# Altium schematic sheet constantCV.SchDoc
size A4; SheetNumber: 1; SheetTotal: 4
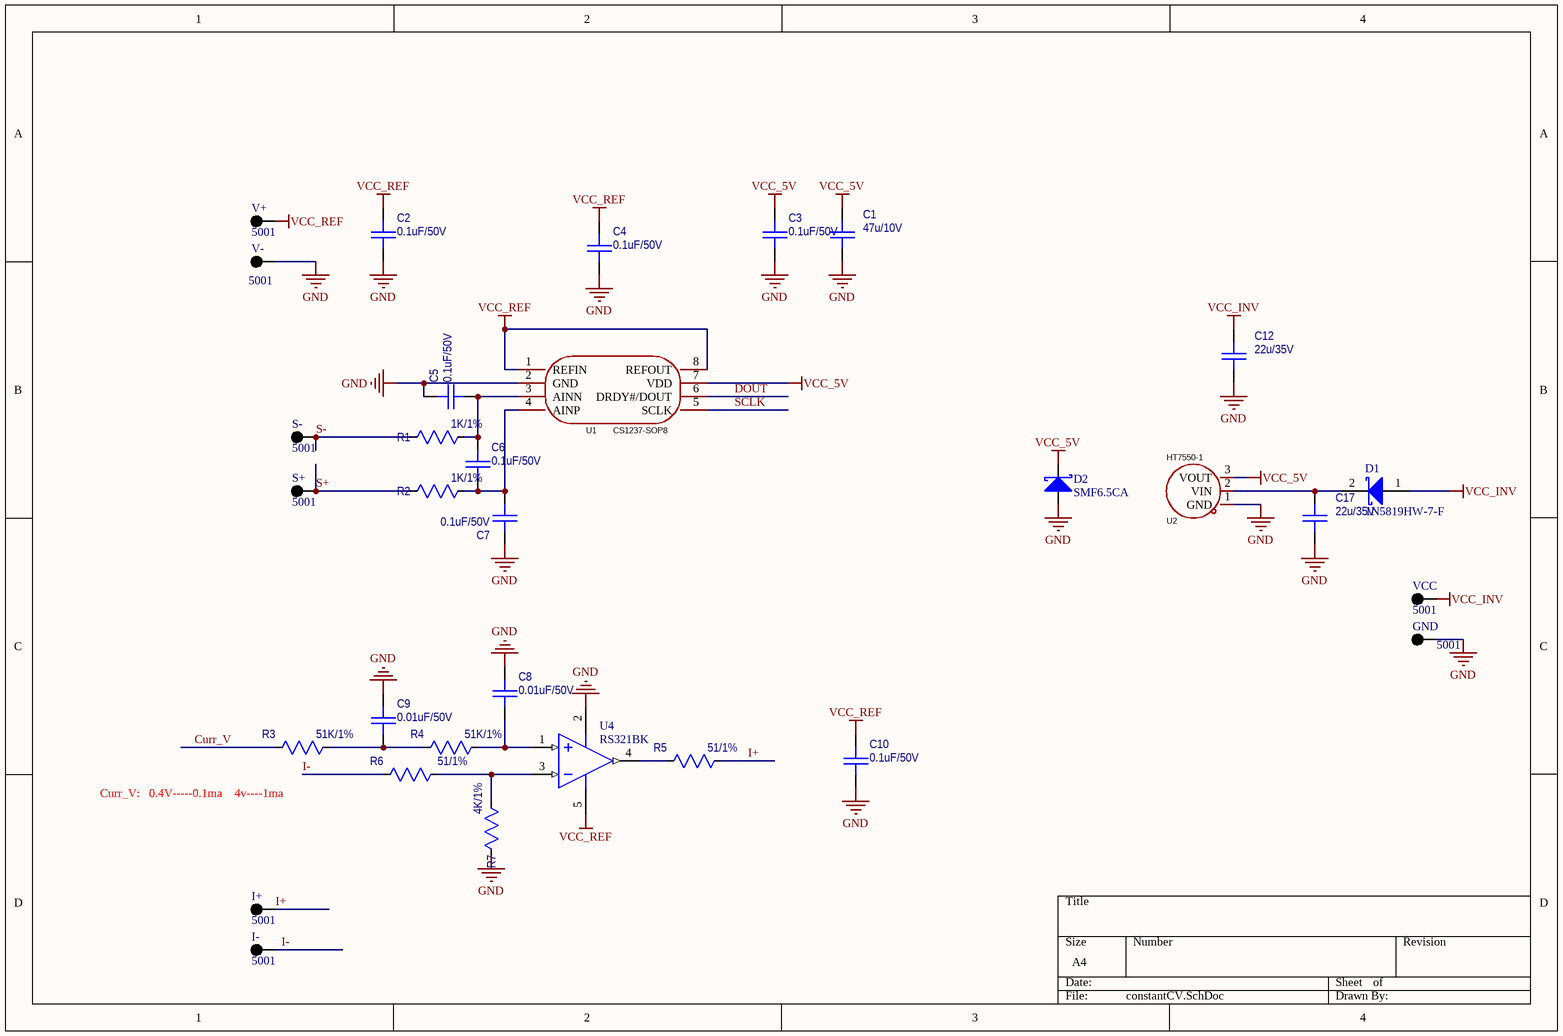
[diagram p0: constantCV.SchDoc]

## Parts
C1  47u/10V  [CAPC2012X127N_0805]
C2  0.1uF/50V  [CAPC1608X092N_0603]
C3  0.1uF/50V  [CAPC1608X092N_0603]
C4  0.1uF/50V  [CAPC1608X092N_0603]
C5  0.1uF/50V  [CAPC1608X092N_0603]
C6  0.1uF/50V  [CAPC1608X092N_0603]  (no BOM)
C7  0.1uF/50V  [CAPC1608X092N_0603]
C8  0.01uF/50V  [CAPC1608X092N_0603]
C9  0.01uF/50V  [CAPC1608X092N_0603]
C10  0.1uF/50V  [CAPC1608X092N_0603]
C12  22u/35V  [CAPC2012X127N_0805]
C17  22u/35V  [CAPC2012X127N_0805]
D1  1N5819HW-7-F  [DIOD-SOD-123-2_V]
D2  SMF6.5CA  [SOD123]
GND  5001  [KSTN-5001]  (no BOM)
I+  5001  [KSTN-5001]  (no BOM)
I-  5001  [KSTN-5001]  (no BOM)
R1  1K/1%  [RESC1608X055N_0603]
R2  1K/1%  [RESC1608X055N_0603]
R3  51K/1%  [RESC1608X055N_0603]
R4  51K/1%  [RESC1608X055N_0603]
R5  51/1%  [RESC1608X055N_0603]
R6  51/1%  [RESC1608X055N_0603]
R7  4K/1%  [RESC1608X055N_0603]
S+  5001  [KSTN-5001]  (no BOM)
S-  5001  [KSTN-5001]  (no BOM)
U1  CS1237-SOP8  [SOIC-8_L5.0-W4.0-P1.27-LS6.0-BL]
U2  HT7550-1  [SOT-89_L4.5-W2.5-P1.50-LS4.2-BR]
U4  RS321BK  [SHBL-SOT-23-5_N]
V+  5001  [KSTN-5001]  (no BOM)
V-  5001  [KSTN-5001]  (no BOM)
VCC  5001  [KSTN-5001]  (no BOM)

## Nets
GND: C1.2 C2.2 C3.2 C4.2 C5.1 C7.1 C8.1 C9.1 C10.2 C12.2 C17.2 D2.1(A) GND.1 R7.2 U1.2(GND) U2.1(GND) U4.2(VSS) V-.1
VCC_5V: C1.1 C3.1 D2.2(K) U1.7(VDD) U2.3(VOUT)
VCC_INV: C12.1 D1.1(A) VCC.1
VCC_REF: C2.1 C4.1 C10.1 U1.1(REFIN) U1.8(REFOUT) U4.5(VDD) V+.1
Curr_V: R3.2
DOUT: U1.6(DRDY#/DOUT)
I+: I+.1 R5.1
I-: I-.1 R6.2
S+: R2.2 S+.1
S-: R1.2 S-.1
SCLK: U1.5(SCLK)
NetC5_2: C5.2 C6.1 R1.1 U1.3(AINN)
NetC6_2: C6.2 C7.2 R2.1 U1.4(AINP)
NetC8_2: C8.2 R4.1 U4.1(IN+)
NetC9_2: C9.2 R3.1 R4.2
NetC17_1: C17.1 D1.2(K) U2.2(VIN)
NetR5_2: R5.2 U4.4(OUT)
NetR6_1: R6.1 R7.1 U4.3(IN-)

## Notes on the sheet
- (near R3) Curr_V:   0.4V-----0.1ma    4v----1ma

## Library data of the parts
C1 C12 C17 = Capacitor_0805: Capacitor, MLCC; Manufacturer: KEMET; PartNumber: C0805C106K8PACTU; Tolerance: [tol]; TempCo: [tempco]; Voltage Rating: [voltage]; ComponentLink1URL: *; Current Rating: *; ComponentLink1Description: Datasheet; Power Rating: *; Package: 0805; SupplierDescription: CAP CER 10UF 10V X5R 0805
  C1: Value: 47u/10V
  C12 C17: Value: 22u/35V
C2-C10 = Capacitor_0603: Capacitor, MLCC; Manufacturer: KEMET; PartNumber: C0603C104M5RACTU; Tolerance: [tol]; TempCo: [tempco]; Voltage Rating: [voltage]; ComponentLink1URL: *; Current Rating: *; ComponentLink1Description: Datasheet; Power Rating: *; Package: 0603; SupplierDescription: CAP CER 0.1UF 50V X7R 0603
  C2-C7 C10: Value: 0.1uF/50V
  C8 C9: Value: 0.01uF/50V
D1 = 1N5819HW-7-F: Total Capacitance CT (pF): 50; Peak Forward Surge Current IFSM (A): 25; Peak Repetitive Reverse Voltage VRRM (V): 40; Packing: Tape and Reel; VR (RMS) (V): 28; RoHS: TRUE; PartNumber: 1N5819HW-7-F; PackageDescription: 2-Pin SOD-123, Body 2.7 x 1.55 mm, Pitch 3.7 mm; Operating and Storage Temperature Range: -65 to 125 degC; Mounting Technology: Surface Mount; PackageReference: SOD-123-2; Maximum Reverse Current IR (uA): 50; Value: 1N5819HW-7-F
D2 = DIODE S: Value: SMF6.5CA
GND I+ I- S+ S- V+ V- VCC = 5001: Test Point, Black, 1-Pin THD, RoHS, Bulk; Manufacturer: Keystone; Value: 5001
R1-R7 = Resistor_0603: Resistor, Standard; Manufacturer: Yageo; PartNumber: RC0603FR-1075KL; Power Rating: [power]; TempCo: [tempco]; Tolerance: tol; ComponentLink1URL: *; ComponentLink1Description: Datasheet; Package: 0603; SupplierDescription: RES SMD 75K OHM 1% 1/10W 0603
  R1 R2: Value: 1K/1%
  R3 R4: Value: 51K/1%
  R5 R6: Value: 51/1%
  R7: Value: 4K/1%
U1 = CS1237-SOP8: Manufacturer: CHIPSEA(芯海科技); Add into BOM: yes; Symbol: CS1237-SO; Device: CS1237-SOP8; LCSC Part Name: 1通道 24位ADC SPI接口; Supplier Part: C77801; Manufacturer Part: CS1237-SOP8; Supplier Footprint: SOP-8-150mil; JLCPCB Part Class: Extended Part; Datasheet: https://atta.szlcsc.com/upload/public/pdf/source/20160706/1467801115662.pdf; Supplier: LCSC; Convert to PCB: yes; Value: CS1237-SOP8
U2 = HT7550-1_C347189: Manufacturer: UMW(友台半导体); Add into BOM: yes; Output Type: 固定; Maximum Input Voltage: 30V; Output Voltage: 5V; Output Current: 100mA; Dropout Voltage: 100mV@(1mA); standby current: 3uA; Output Polarity: 正极; Number of Outputs: 1; Symbol: HT7550-1_C347189; Device: HT7550-1_C347189; LCSC Part Name: 输入30V 输出5V 100mA; Supplier Part: C347189; Manufacturer Part: HT7550-1; Supplier Footprint: SOT-89; JLCPCB Part Class: Extended Part; Datasheet: https://atta.szlcsc.com/upload/public/pdf/source/20241210/442D8F583BE08BBCCA568BF38D964031.pdf; Supplier: LCSC; Convert to PCB: yes; Power Supply Rejection Ratio (PSRR): -; Noise: -; Operating Temperature: -25℃~+70℃; Value: HT7550-1
U4 = BL321LFR: 1 MHz Rail-to-Rail IO Operational Amplifier, Single Channel, -40 to 125 degC, 5-Pin SOT23, RoHS, Tape and Reel; Manufacturer: Shanghai Belling; Operating Temperature Range(C): -40 to 150; PartNumber: BL321LFR; Publisher: Bolgen Studio; Package Reference: SOT23-5; Package Description: 5-Pin Small Outline Transistor, Body 1.6 x 2.9 mm, Pitch 0.95 mm; Value: RS321BK